# EAGLE schematic open-lab-mon-A-mini (EAGLE 6.5.0)
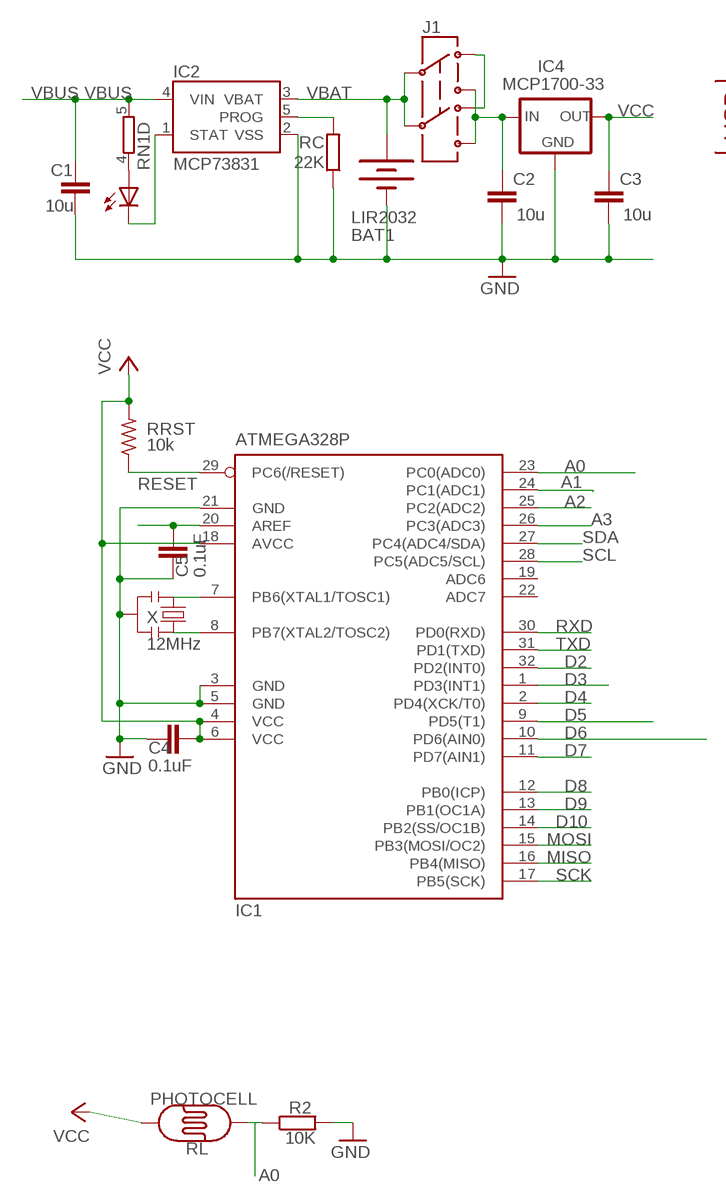
[diagram p0: schematic, sheet 1, part 1 of 2]
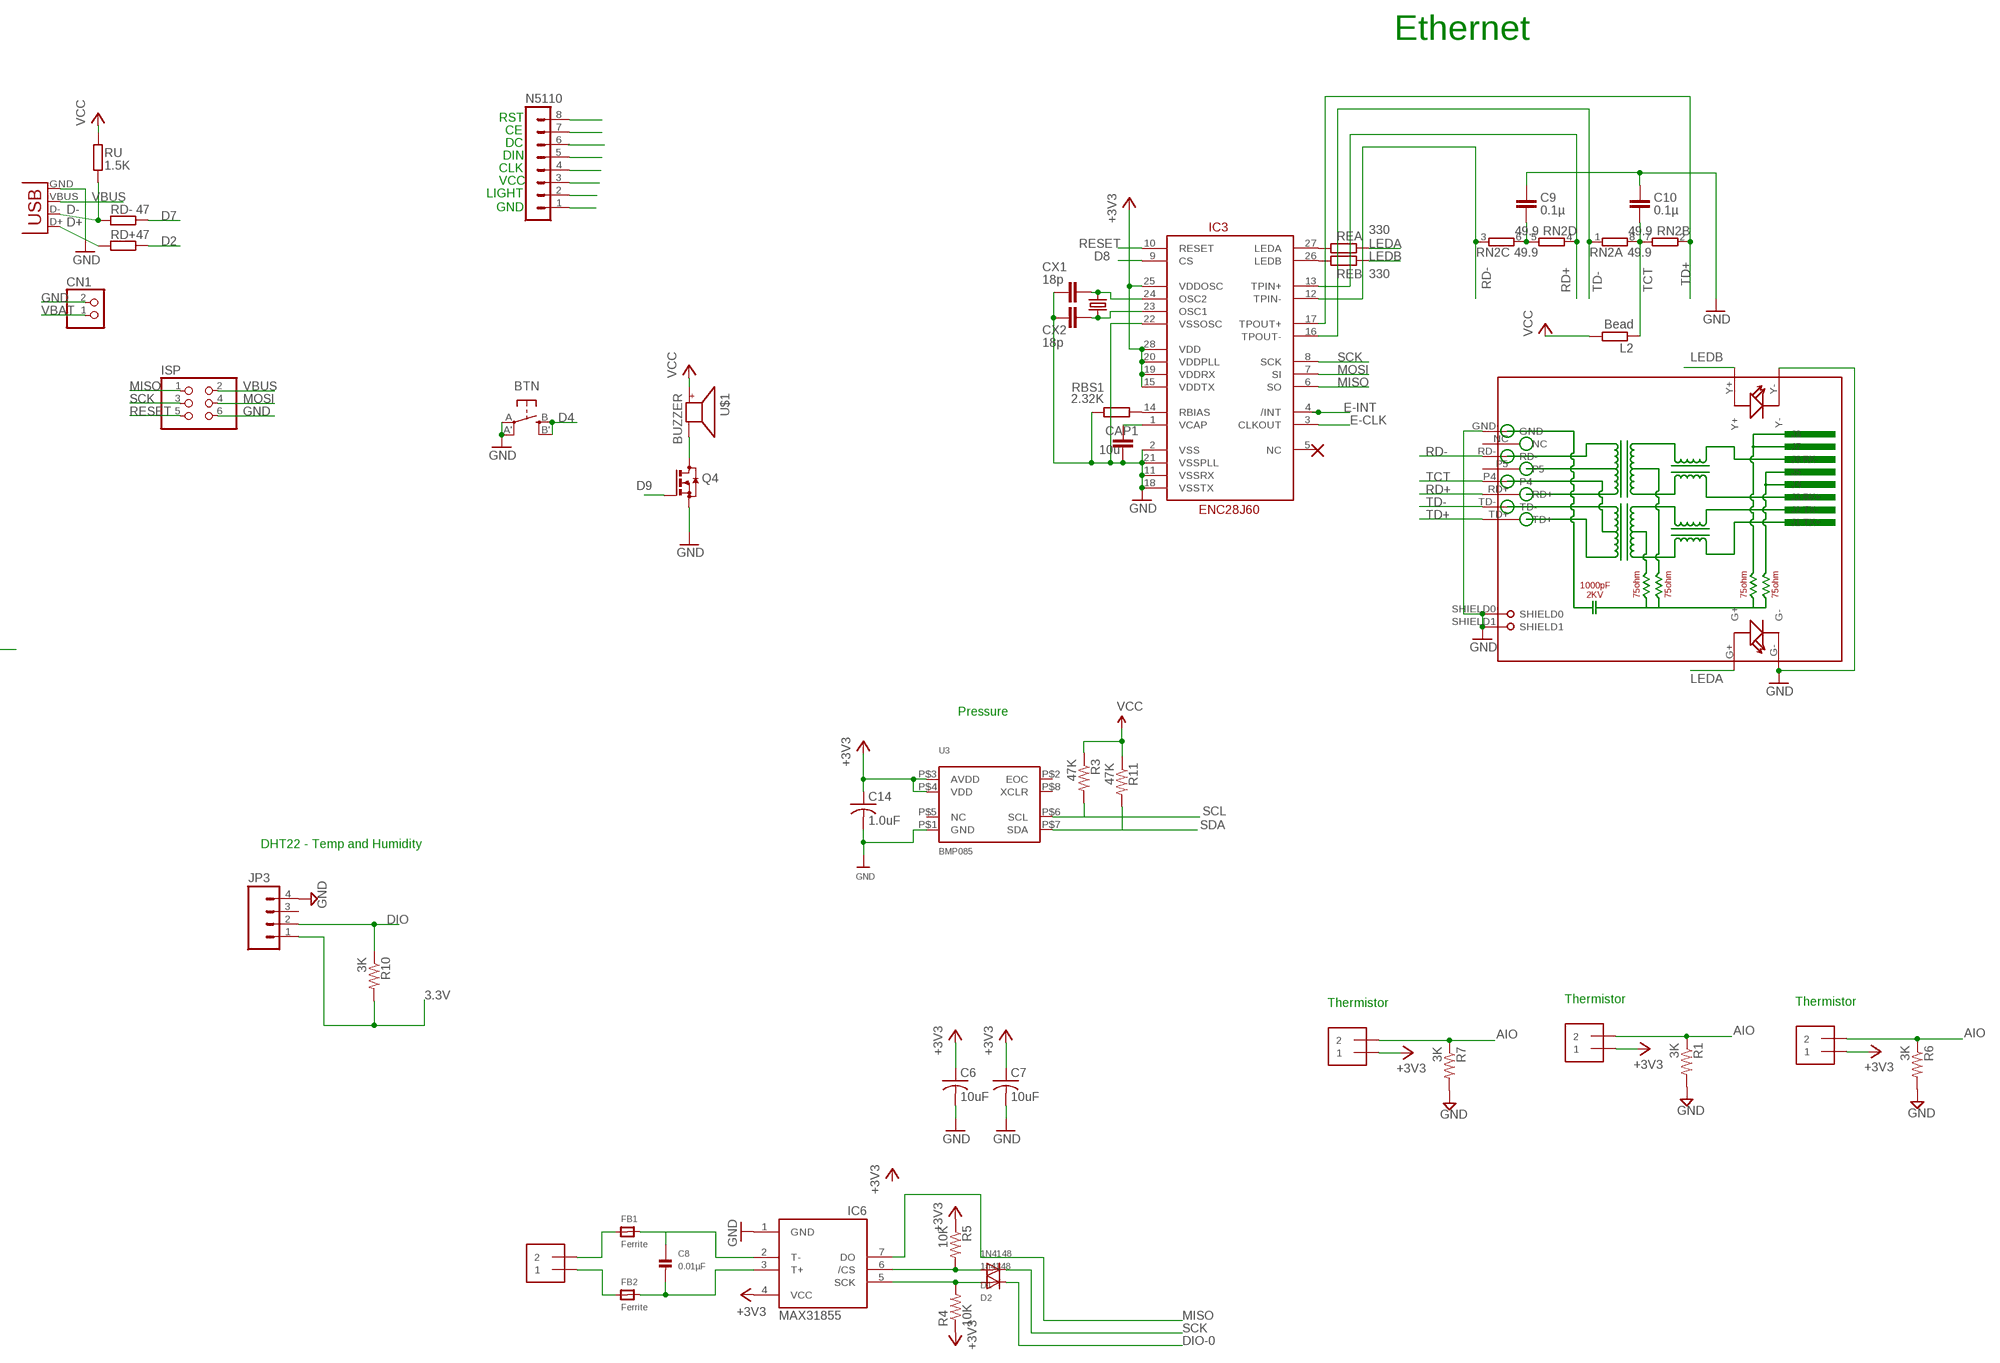
[diagram p1: schematic, sheet 1, part 2 of 2]

## Parts
BAT1  LIR2032  BATTERYBATTCOM_20MM_PTH_SMT  [BATTCOM_20MM_PTH_SMT]
BTN  EVQQ2  [EVQ-Q2]
C1  10u  C-EUC0805  [C0805]
C2  10u  C-EUC0805  [C0805]
C3  10u  C-EUC0805  [C0805]
C4  0.1uF  C-EUC0805  [C0805]
C5  0.1uF  C-EUC0805  [C0805]
C6  10uF  C-USC0805K  [C0805K]
C7  10uF  C-USC0805K  [C0805K]
C8  0.01µF  CAP_CERAMIC_0805  [_0805]
C9  0.1µ  C-EUC0805  [C0805]
C10  0.1µ  C-EUC0805  [C0805]
C14  1.0uF  C-USC0805  [C0805]
CAP1  10u  C-EUC0805  [C0805]
CHG  0805  LEDCHIPLED_0805  [CHIPLED_0805]
CN1  JST_2PIN-SMT-RA  [JST-PH-2-SMT-RA]
CX1  18p  C-EUC0805  [C0805]
CX2  18p  C-EUC0805  [C0805]
D1  1N4148  DIODESOD-323F  [SOD-323F]
D2  1n4148  DIODESOD-323F  [SOD-323F]
FB1  Ferrite  FERRITE_0805  [_0805]
FB2  Ferrite  FERRITE_0805  [_0805]
IC1  ATMEGA328P  MEGA8-AI  [TQFP32-08]
IC2  MCP73831  [SOT23-5]
IC3  ENC28J60  ENC28J60SO28LONG  [SOIC28WLONG]
IC4  MCP1700-33  MCP1700SOT233  [SOT23]
IC6  MAX31855  MAX6675  [SO08]
ISP  PINHD-2X3  [2X03]
J1  AYZ0202  [AYZ0202]
J2  1X2-3.5MM  [1X2-3.5MM]
J3  1X2-3.5MM  [1X2-3.5MM]
J4  1X2-3.5MM  [1X2-3.5MM]
J5  1X2-3.5MM  [1X2-3.5MM]
JP3  M04LOCK  [1X04_LOCK]
L2  Bead  R-EU_R0805  [R0805]
N5110  MA08-1  [MA08-1]
Q4  BSS123  [SOT23]
R1  3K  R-US_R0805  [R0805]
R2  10K  R-EU_R0805  [R0805]
R3  47K  R-US_R0805  [R0805]
R4  10K  R-US_R0805  [R0805]
R5  10K  R-US_R0805  [R0805]
R6  3K  R-US_R0805  [R0805]
R7  3K  R-US_R0805  [R0805]
R10  3K  R-US_R0805  [R0805]
R11  47K  R-US_R0805  [R0805]
RBS1  2.32K  R-EU_R0805  [R0805]
RC  22K  R-EU_R0805  [R0805]
RD+  47  R-EU_R0805  [R0805]
RD-  47  R-EU_R0805  [R0805]
REA  330  R-EU_R0805  [R0805]
REB  330  R-EU_R0805  [R0805]
RJ1  HR911105A  [HR911105A]
RL  PHOTOCELL  PHOTOCELLPTH  [PHOTOCELL]
RN1  4R-NEXB38V  [EXB38V]
RN2  49.9  4R-NEXB38V  [EXB38V]
RRST  10k  R-US_R0805  [R0805@1]
RU  1.5K  R-EU_R0805  [R0805]
U3  BMP085  [BMP085]
U$1  BUZZER  [SMT-8585-BUZZER]
X  12MHz  RESONATORSMD  [RESONATOR-SMD]
X1  USBSMD  [USB-MINIB]
X2A  25MHz  CRYSTAL10.5X4.8  [CRYSTAL-SMD-10.5X4.8-2PIN]

## Nets
3.3V [power]: JP3.1 R10.2
+3V3: C6.1 C7.1 C14.1 IC3.15(VDDTX) IC3.19(VDDRX) IC3.20(VDDPLL) IC3.25(VDDOSC) IC3.28(VDD) IC6.4(VCC) J3.1 J4.1 J5.1 R4.1 R5.1 U3.P$3(AVDD) U3.P$4(VDD)
A0: IC1.23(PC0(ADC0)) R2.1 RL.1
A1: IC1.24(PC1(ADC1))
A2: IC1.25(PC2(ADC2))
A3: IC1.26(PC3(ADC3))
AIO: J3.2 J4.2 J5.2 R1.1 R6.1 R7.1
AREF: C5.2 IC1.20(AREF)
CS: D1.A IC6.6(/CS) R5.2
D2: IC1.32(PD2(INT0)) RD+.2
D3: IC1.1(PD3(INT1))
D4: BTN.B'(S1) BTN.B(S) IC1.2(PD4(XCK/T0))
D5: IC1.9(PD5(T1))
D6: IC1.10(PD6(AIN0))
D7: IC1.11(PD7(AIN1)) RD-.2
D8: IC1.12(PB0(ICP)) IC3.9(CS)
D9: IC1.13(PB1(OC1A)) Q4.1(G)
D10: IC1.14(PB2(SS/OC1B))
D+: RD+.1 X1.D+
D-: RD-.1 RU.1 X1.D-
DIO: JP3.2 R10.1
DIO-0: D2.C
E-CLK: IC3.3(CLKOUT)
E-INT: IC3.4(/INT)
GND: BAT1.P$1(-) BTN.A'(P1) BTN.A(P) C1.2 C2.2 C3.2 C4.1 C5.1 C6.2 C7.2 C9.1 C10.1 C14.2 CAP1.2 CN1.2 CX1.2 CX2.2 IC1.3(GND) IC1.5(GND) IC1.21(GND) IC2.2(VSS) IC3.2(VSS) IC3.11(VSSRX) IC3.18(VSSTX) IC3.21(VSSPLL) IC3.22(VSSOSC) IC4.1(GND) IC6.1(GND) ISP.6 JP3.4 Q4.2(S) R1.2 R2.2 R6.2 R7.2 RBS1.1 RC.1 RJ1.G- RJ1.GND RJ1.SHIELD0 RJ1.SHIELD1 RJ1.Y- U3.P$1(GND) X1.GND X.2
LEDA: REA.2 RJ1.G+
LEDB: REB.2 RJ1.Y+
MISO: IC1.16(PB4(MISO)) IC3.6(SO) IC6.7(DO) ISP.1
MOSI: IC1.15(PB3(MOSI/OC2)) IC3.7(SI) ISP.4
N$1: J1.3 J1.6
N$2: IC1.7(PB6(XTAL1/TOSC1)) X.1
N$3: IC1.8(PB7(XTAL2/TOSC2)) X.3
N$4: C9.2 RN2.5 RN2.6
N$5: CHG.C IC2.1(STAT)
N$6: IC2.5(PROG) RC.2
N$7: Q4.3(D) U$1.-
N$8: FB1.1 J2.2
N$9: C8.1 FB1.2 IC6.2(T-)
N$10: CHG.A RN1.4
N$11: FB2.1 J2.1
N$12: C8.2 FB2.2 IC6.3(T+)
N$13: N5110.8
N$14: IC3.27(LEDA) REA.1
N$15: IC3.26(LEDB) REB.1
N$16: CAP1.1 IC3.1(VCAP)
N$17: IC3.14(RBIAS) RBS1.2
N$18: CX1.1 IC3.24(OSC2) X2A.P$2
N$19: CX2.1 IC3.23(OSC1) X2A.P$1
N$20: N5110.7
N$22: N5110.5
N$23: N5110.4
N$24: N5110.3
N$25: N5110.2
N$26: N5110.1
RD+: IC3.13(TPIN+) RJ1.RD+ RN2.4
RD-: IC3.12(TPIN-) RJ1.RD- RN2.3
RESET: IC1.29(PC6(/RESET)) IC3.10(RESET) ISP.5 RRST.1
RXD: IC1.30(PD0(RXD))
SCK: D1.C IC1.17(PB5(SCK)) IC3.8(SCK) ISP.3
SCK1: D2.A IC6.5(SCK) R4.2
SCL: IC1.28(PC5(ADC5/SCL)) U3.P$6(SCL)
SCL1: R3.2
SDA: IC1.27(PC4(ADC4/SDA)) U3.P$7(SDA)
SDA1: R11.2
TCT: C10.2 L2.1 RJ1.P4 RN2.7 RN2.8
TD+: IC3.17(TPOUT+) RJ1.TD+ RN2.2
TD-: IC3.16(TPOUT-) RJ1.TD- RN2.1
TXD: IC1.31(PD1(TXD))
VBAT: BAT1.P$2(+) CN1.1 IC2.3(VBAT) J1.2 J1.5
VBUS: C1.1 IC2.4(VIN) ISP.2 RN1.5 X1.VBUS
VCC: C3.1 C4.2 IC1.4(VCC) IC1.6(VCC) IC1.18(AVCC) IC4.2(OUT) L2.2 R3.1 R11.1 RL.2 RRST.2 RU.2 U$1.+
VDD: C2.1 IC4.3(IN) J1.1 J1.4
Unconnected: IC1.19(ADC6) IC1.22(ADC7) IC3.5(NC) JP3.3 N5110.6 RJ1.NC RJ1.P5 RN1.1 RN1.2 RN1.3 RN1.6 RN1.7 RN1.8 U3.P$2(EOC) U3.P$5(NC) U3.P$8(XCLR)

## Notes on the sheet
- Ethernet
- RST
- CE
- DC
- DIN
- CLK
- VCC
- LIGHT
- GND
- Pressure
- DHT22 - Temp and Humidity
- Thermistor | Thermistor
- Thermistor

## Library data of the parts
BAT1 = SparkFunNew:BATTERY: Battery Holders Various common sizes : AA, AAA, 20mm coin cell and 12mm coin cell.
BTN = adafruit:EVQQ2: SMT 6mm switch, EVQQ2 series http://www.ladyada.net/library/eagle
C1-C3 C9 C10 CAP1 CX1 CX2 = resistor:C-EU: CAPACITOR, European symbol
C4 C5 = rcl:C-EU: CAPACITOR, European symbol
C6 C7 C14 = adafruit:C-US: CAPACITOR, American symbol
C8 = microbuilder:CAP_CERAMIC: Ceramic Capacitors 0402 - 0402 Surface Mount Capacitors 16pF 50V 5% [Digikey: 445-4899-2-ND] 18pF 50V 5% [Digikey: 490-1281-2-ND] 22pF 50V 5% [Digikey: 490-1283-2-ND] 68pF 50V 5% [Digikey: 490-1289-2-ND] 0.1uF 10V 10% [Digikey: 490-1318-2-ND] 1.0uF 6.3V 10% [Digikey: 490-1320-2-ND] 0603 - 0603 Surface Mount Capacitors 16 pF 50V 5% [Digikey: 445-5051-2-ND] 22 pF 50V [Digikey: PCC220ACVTR-ND] 33 pF 50V 5% [Digikey: 490-1415-1-ND] 56pF 50V 5% [Digikey: 490-1421-1-ND] 220pF 50V 5% [Digikey: 445-1285-1-ND] 680 pF 50V 2200 pF 50V 5% C0G [Digikey: 445-1297-1-ND] 5600 pF 100V 5% X7R [Digikey: 478-3711-1-ND] 0.1 µF 25V 10% [Digikey: PCC2277TR-ND] 0.22 µF 16V 10% X7R [Digikey: 445-1318-1-ND] 1.0 µF 25V 10% [Digikey: 445-5146-2-ND] 0603 - RF Specific 3pF 250V +/-0.1pF RF [Digikey: 712-1347-1-ND] 18 pF 250V 5% [Digikey: 478-3505-1-ND or 712-1322-1-ND] 56 pF 250V 5% C0G RF [Digikey: 490-4867-1-ND] 68 pF 250V RF [Digikey: 490-4868-1-ND] 0805 - 0805 Surface Mount Capacitors 220 pF 250V 2% RF Ceramic Capacitor [Digikey: 712-1398-1-ND] 1000 pF 50V 2% NP0 Ceramic Capacitor [Digikey: 478-3760-1-ND] 0.1 µF 25V 10% Ceramic Capacitor [Digikey: PCC1828TR-ND] 1.0 µF 16V 10% Ceramic Capacitor[Digikey: 490-1691-2-ND] 10.0 µF 10V 10% Ceramic Capacitor[Digikey: 709-1228-1-ND] 10.0 uF 16V 10% Ceramic Capacitor [Digikey: 478-5165-2-ND] 47 uF 6.3V 20% Ceramic Capacitor [Digikey: 587-1779-1-ND or 399-5506-1-ND] 1206 - 1206 Surface Mount Capacitors 47uF 10V 20% Ceramic Capacitor [Digikey: 490-5528-1-ND or 399-5508-1-ND or 445-6010-1-ND] 100uF 6.3V -20%, +80% Y5V Ceramic Capacitor (Digikey: 490-4512-1-ND, Mouser: 81-GRM31CF50J107ZE1L)
CHG = led:LED: LED OSRAM: - CHIPLED LG R971, LG N971, LY N971, LG Q971, LY Q971, LO R971, LY R971 LH N974, LH R974 LS Q976, LO Q976, LY Q976 LO Q996 - Hyper CHIPLED LW Q18S LB Q993, LB Q99A, LB R99A - SideLED LS A670, LO A670, LY A670, LG A670, LP A670 LB A673, LV A673, LT A673, LW A673 LH A674 LY A675 LS A676, LA A676, LO A676, LY A676, LW A676 LS A679, LY A679, LG A679 - Hyper Micro SIDELED® LS Y876, LA Y876, LO Y876, LY Y876 LT Y87S - SmartLED LW L88C, LW L88S LB L89C, LB L89S, LG L890 LS L89K, LO L89K, LY L89K LS L896, LA L896, LO L896, LY L896 - TOPLED LS T670, LO T670, LY T670, LG T670, LP T670 LSG T670, LSP T670, LSY T670, LOP T670, LYG T670 LG T671, LOG T671, LSG T671 LB T673, LV T673, LT T673, LW T673 LH T674 LS T676, LA T676, LO T676, LY T676, LB T676, LH T676, LSB T676, LW T676 LB T67C, LV T67C, LT T67C, LS T67K, LO T67K, LY T67K, LW E67C LS E67B, LA E67B, LO E67B, LY E67B, LB E67C, LV E67C, LT E67C LW T67C LS T679, LY T679, LG T679 LS T770, LO T770, LY T770, LG T770, LP T770 LB T773, LV T773, LT T773, LW T773 LH T774 LS E675, LA E675, LY E675, LS T675 LS T776, LA T776, LO T776, LY T776, LB T776 LHGB T686 LT T68C, LB T68C - Hyper Mini TOPLED® LB M676 - Mini TOPLED Santana® LG M470 LS M47K, LO M47K, LY M47K Source: http://www.osram.convergy.de LUXEON: - LUMILED® LXK2-PW12-R00, LXK2-PW12-S00, LXK2-PW14-U00, LXK2-PW14-V00 LXK2-PM12-R00, LXK2-PM12-S00, LXK2-PM14-U00 LXK2-PE12-Q00, LXK2-PE12-R00, LXK2-PE12-S00, LXK2-PE14-T00, LXK2-PE14-U00 LXK2-PB12-K00, LXK2-PB12-L00, LXK2-PB12-M00, LXK2-PB14-N00, LXK2-PB14-P00, LXK2-PB14-Q00 LXK2-PR12-L00, LXK2-PR12-M00, LXK2-PR14-Q00, LXK2-PR14-R00 LXK2-PD12-Q00, LXK2-PD12-R00, LXK2-PD12-S00 LXK2-PH12-R00, LXK2-PH12-S00 LXK2-PL12-P00, LXK2-PL12-Q00, LXK2-PL12-R00 Source: www.luxeon.com KINGBRIGHT: KA-3528ASYC Source: www.kingbright.com
CN1 = adafruit:JST_2PIN: JST 2-Pin Connectors of various flavors SMT-RA (S2B-PH-SM4) 4UConnector #17311 SMT (B2B-PH-SM4) THM-RA (S2B-PH) THM (B2B-PH)
D1 D2 = adafruit:DIODE: Diode SMADIODE - SMA Surface Mount Package 20V 1A Schottky Diode Digikey: 641-1014-6-ND DO-1N4148 - Through Hole Small Current Diode SOD-123 20V 1 A (.5mV Vf) Schottky Diode - Digikey: MBRX120TPMSCT-ND SOD-323 10V 570mA (.38mV Vf, 3ns) Schottky Diode - Digikey: ZLLS410CT-ND SOD-523 30V 30mA Schottky Diode (RB751S-40TE61) - Digikey: RB751S-40TE61CT-ND SOT23-R/W - SOT23 Package (R = Solder Paste/Reflow Ovens, W = Hand-Soldering) BAT54Film 40V 300mA - Digikey: 497-7162-1-ND
FB1 FB2 = microbuilder:FERRITE: Ferrite Bead 0603 MMZ1608B121C - 120 Ohm @ 100MHz, 600mA, 0.15 Ohm DC Resistance - Digikey: 445-2164-1-ND BK1608HW121-T - 120 Ohm, 600mA Ferrite Chip - Digikey: 587-1876-2-ND 0805 HZ0805B272R-10 - 2.7K Ohm @ 100MHz, 200mA, 0.8 Ohm DC Resistance - Digikey: 240-2504-1-ND (see also Murata BLM21BD272SN1L) MMZ2012Y152B - 1.5K Ohm @ 100MHz, 500mA, 0.4 Ohm DC Resistance - Digikey: 445-1560-1-ND - Mainly for high frequency (80-400MHz) MMZ2012R102A - 1K Ohm @ 100MHz, 500mA, 0.3 Ohm DC Resistance - Digikey: 445-1555-2-ND - More general purpose (10-200MHz)
IC1 = atmel:MEGA8: MICROCONTROLLER 8 Kbytes FLASH, 1 kbytes SRAM, 512 bytes EEPROM, USART, 6-channel 10 bit ADC, 2-channel 8 bit ADC Pin compatible with Atmega48, ATMega88, ATMega168 Source: avr.lbr; MPN: ATMEGA8-16AU; OC_FARNELL: 9171371; OC_NEWARK: 73M8863
IC2 = SparkFunNew:MCP73831: Microchip's MCP73831 Miniature single cell, fully integrated Li-Ion, Li-polymer charge management controller http://ww1.microchip.com/downloads/en/DeviceDoc/21984a.pdf
IC3 = SparkFun:ENC28J60
IC4 = adafruit:MCP1700: VOLTAGE REGULATOR
IC6 = adafruit:MAX6675
ISP = pinhead:PINHD-2X3: PIN HEADER
J1 = SparkFunNew:AYZ0202: SPDT Slide Switch Simple SMD single-pull double-throw slide switch. Good for less than 350mA power switch, switching UARTs between devices, etc. Spark Fun Electronics SKU : COM-00597
J2-J5 = adafruit:1X2: 3.5mm Terminal block http://www.ladyada.net/library/pcb/eaglelibrary.html
JP3 = SparkFun-Connectors:M04: Header 4 Standard 4-pin 0.1" header. Use with straight break away headers (SKU : PRT-00116), right angle break away headers (PRT-00553), swiss pins (PRT-00743), machine pins (PRT-00117), and female headers (PRT-00115). Molex polarized connector foot print use with SKU : PRT-08231 with associated crimp pins and housings. 1MM SMD Version SKU: PRT-10208
L2 R2 RBS1 RC RD+ RD- REA REB RU = rcl:R-EU_: RESISTOR, European symbol
N5110 = con-lstb:MA08-1: PIN HEADER; OC_FARNELL: unknown; OC_NEWARK: unknown
Q4 = transistor-small-signal:BSS123: N-CHANNEL MOS FET
R1 R3-R7 R10 R11 = adafruit:R-US_: RESISTOR, American symbol
RJ1 = CONNECTER:HR911105A
RL = SparkFunNew:PHOTOCELL: Photocell Also known as a CdS photoresistor. This is a low cost way to detect light levels. Resistance decreases with more incoming light. SparkFun SKU: SEN-09088
RN1 RN2 = resistor-dil:4R-N: Array Chip Resistor Source: RS Component / Phycomp; OC_FARNELL: unknown; OC_NEWARK: unknown
RRST = rcl:R-US_: RESISTOR, American symbol
U3 = microbuilder:BMP085: BMP085 Digital Pressure Sensor 1.8-3.6V Supply, I2C Interface
U$1 = adafruit:BUZZER
X = SparkFunNew:RESONATOR: Resonator Small SMD resonator. This is the itty bitty 10/20MHz resonators with built in caps. CSTCE10M0G55 and CSTCE20M0V53. Footprint has been reviewed closely but hasn't been tested yet.
X1 = SparkFun:USB: USB Connectors USB-B-PTH is fully proven SKU : PRT-00139 USB-miniB is fully proven SKU : PRT-00587 USB-A-PCB is untested. USB-A-H is throughly reviewed, but untested. Spark Fun Electronics SKU : PRT-00437 USB-B-SMT is throughly reviewed, but untested. Needs silkscreen touching up. USB-A-S has not been used/tested USB-MB-H has not been used/tested
X2A = SparkFun:CRYSTAL: Crystals Various standard crystals. Proven footprints. Spark Fun Electronics SKU : COM-00534

## Net classes
1 power: width 0.813 mm, drill 0.254 mm, clearance 0.254 mm